# Altium project PCB_final.PrjPcb
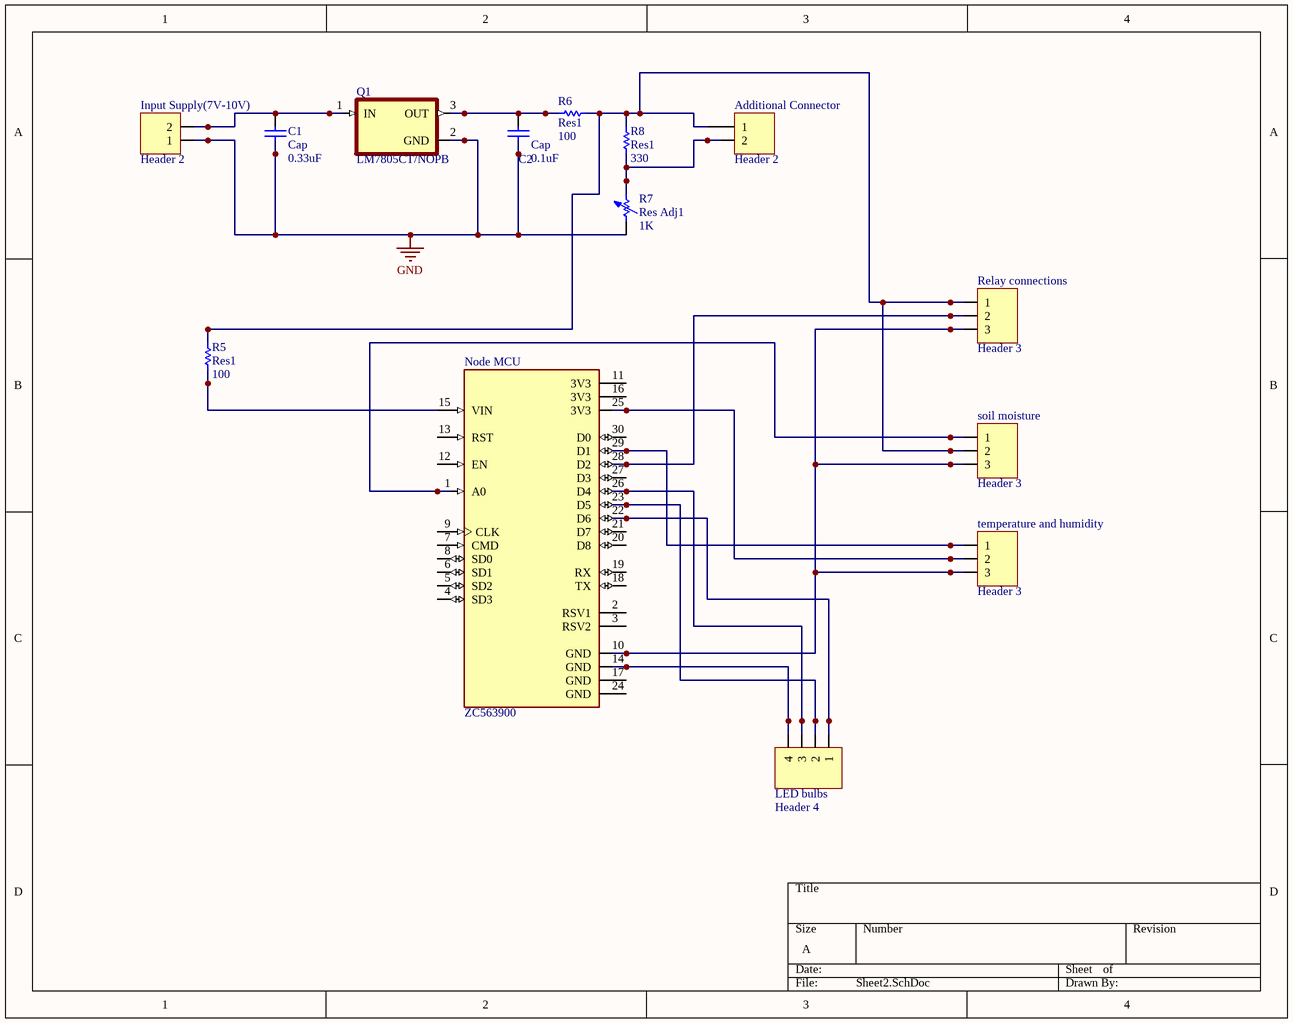
[diagram p0: Sheet2.SchDoc]
1 sheet, 14 parts. Net scope: global (net labels, ports and power ports of the same name join across sheets).
Board file: PCB1.PcbDoc

## Sheet Sheet2.SchDoc
size A

### Parts
Additional_Connector  Header 2  [HDR1X2]
C1  Cap  value 0.33uF  [RAD-0.3]
C2  Cap  value 0.1uF  [RAD-0.3]
Input_Supply(7V-10V)  Header 2  [HDR1X2]
LED_bulbs  Header 4  [HDR1X4]
Node_MCU  ZC563900  [MODULE_ZC563900]
Q1  LM7805CT/NOPB  [TO254P1054X470X2600-3]
R5  Res1  value 100  [AXIAL-0.3]
R6  Res1  value 100  [AXIAL-0.3]
R7  Res Adj1  value 1K  [AXIAL-0.7]
R8  Res1  value 330  [AXIAL-0.3]
Relay_connections  Header 3  [HDR1X3]
soil_moisture  Header 3  [HDR1X3]
temperature_and_humidity  Header 3  [HDR1X3]

### Nets
GND: C1.1 C2.1 Input_Supply(7V-10V).1 Q1.2(GND) R7.1
NetAdditional_Connector_1: Additional_Connector.1 R5.2 R6.2 R8.2 Relay_connections.1 soil_moisture.2
NetAdditional_Connector_2: Additional_Connector.2 R7.2 R8.1
NetC1_2: C1.2 Input_Supply(7V-10V).2 Q1.1(IN)
NetC2_2: C2.2 Q1.3(OUT) R6.1
NetLED_bulbs_1: LED_bulbs.1 Node_MCU.22(D6)
NetLED_bulbs_2: LED_bulbs.2 Node_MCU.23(D5)
NetLED_bulbs_3: LED_bulbs.3 Node_MCU.26(D4)
NetLED_bulbs_4: LED_bulbs.4 Node_MCU.14(GND)
NetNode_MCU_1: Node_MCU.1(A0) soil_moisture.1
NetNode_MCU_10: Node_MCU.10(GND) Relay_connections.3 soil_moisture.3 temperature_and_humidity.3
NetNode_MCU_15: Node_MCU.15(VIN) R5.1
NetNode_MCU_25: Node_MCU.25(3V3) temperature_and_humidity.2
NetNode_MCU_28: Node_MCU.28(D2) Relay_connections.2
NetNode_MCU_29: Node_MCU.29(D1) temperature_and_humidity.1

Not connected (* = marked no-connect by the designer): Node_MCU 2(RSV1) 3(RSV2) 4(SD3) 5(SD2) 6(SD1) 7(CMD) 8(SD0) 9(CLK) 11(3V3) 12(EN) 13(RST) 16(3V3) 17(GND) 18(TX) 19(RX) 20(D8) 21(D7) 24(GND) 27(D3) 30(D0)

### Library data of the parts
Additional_Connector Input_Supply(7V-10V) = Header 2: Header, 2-Pin; LatestRevisionDate: 17-Jul-2002; LatestRevisionNote: Re-released for DXP Platform.; Publisher: Altium Limited
C1 C2 = Cap: Capacitor; Published: 8-Jun-2000; LatestRevisionDate: 17-Jul-2002; LatestRevisionNote: Re-released for DXP Platform.; PackageReference: RAD-0.3; Publisher: Altium Limited; PackageDescription: Radial Cap, Thru-Hole; 2 Leads; 0.3 in Pin Spacing
LED_bulbs = Header 4: Header, 4-Pin; LatestRevisionDate: 17-Jul-2002; LatestRevisionNote: Re-released for DXP Platform.; Publisher: Altium Limited
Node_MCU = ZC563900: NodeMcu Lua ESP8266 WIFI Internet of Things Network Development Module Board; MF: YKS; MP: ZC563900; Package: None; Price: None; Availability: Unavailable; Value: *; SnapEDA_Link: https://www.snapeda.com/parts/ZC563900/YKS/view-part/607853/?ref=snap
Q1 = LM7805CT/NOPB: Linear Voltage Regulator IC 1 Output 1A TO-220-3; MF: ON Semiconductor; MP: LM7805CT; SnapEDA_Link: https://www.snapeda.com/parts/LM7805CT/ON%20Semiconductor/view-part/546231/?ref=snap; Price: None; Package: TO-220 ON Semiconductor; Value: *; Availability: Unavailable
R5 R6 R8 = Res1: Resistor; Published: 8-Jun-2000; LatestRevisionDate: 17-Jul-2002; LatestRevisionNote: Re-released for DXP Platform.; PackageReference: AXIAL-0.3; Publisher: Altium Limited; PackageDescription: Axial Device, Thru-Hole; 2 Leads; 0.3 in Pin Spacing
R7 = Res Adj1: Variable Resistor; Set Position: 0.5; Published: 8-Jun-2000; LatestRevisionDate: 17-Jul-2002; LatestRevisionNote: Re-released for DXP Platform.; PackageReference: AXIAL-0.7; Publisher: Altium Limited; PackageDescription: Axial Device, Thru-Hole; 2 Leads; 0.7 in Pin Spacing
Relay_connections soil_moisture temperature_and_humidity = Header 3: Header, 3-Pin; LatestRevisionDate: 17-Jul-2002; LatestRevisionNote: Re-released for DXP Platform.; Publisher: Altium Limited